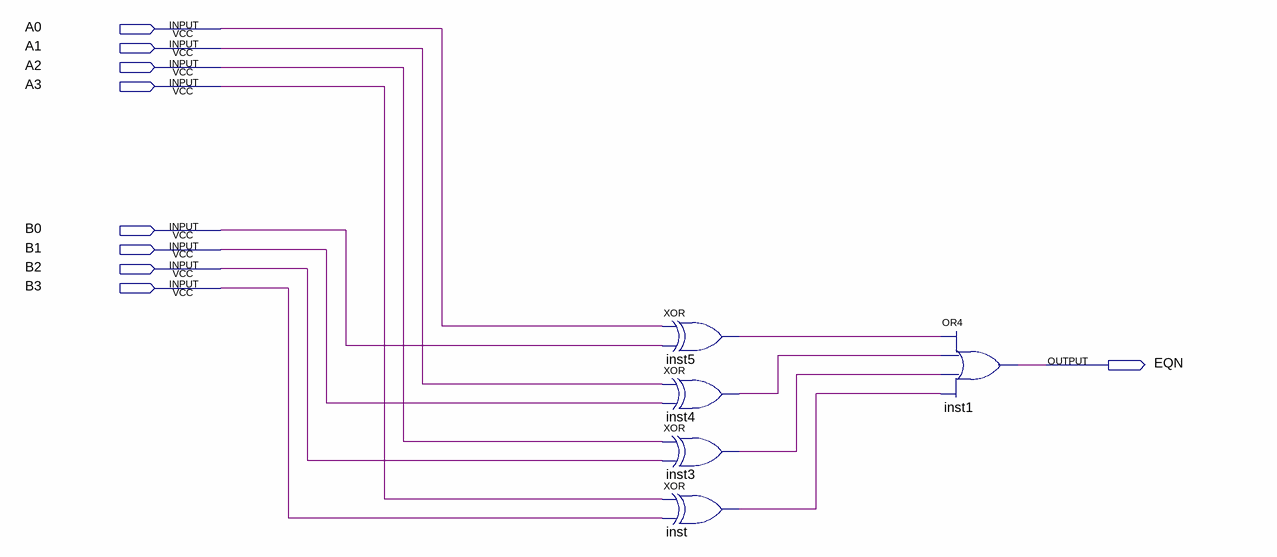
[diagram p0: schematic sheet]
// Quartus schematic eq_4bits.bdf as structural Verilog: 5 symbols, 9 pins
module eq_4bits (
  input  A0,
  input  A1,
  input  A2,
  input  A3,
  input  B0,
  input  B1,
  input  B2,
  input  B3,
  output EQN
);

  wire inst3_out, inst4_out, inst5_out, inst_out;

  xor inst5 (inst5_out, A0, B0);
  xor inst4 (inst4_out, A1, B1);
  xor inst3 (inst3_out, A2, B2);
  xor inst (inst_out, A3, B3);
  or inst1 (EQN, inst5_out, inst4_out, inst3_out, inst_out);
endmodule
